# Altium project relayesp.PrjPcb
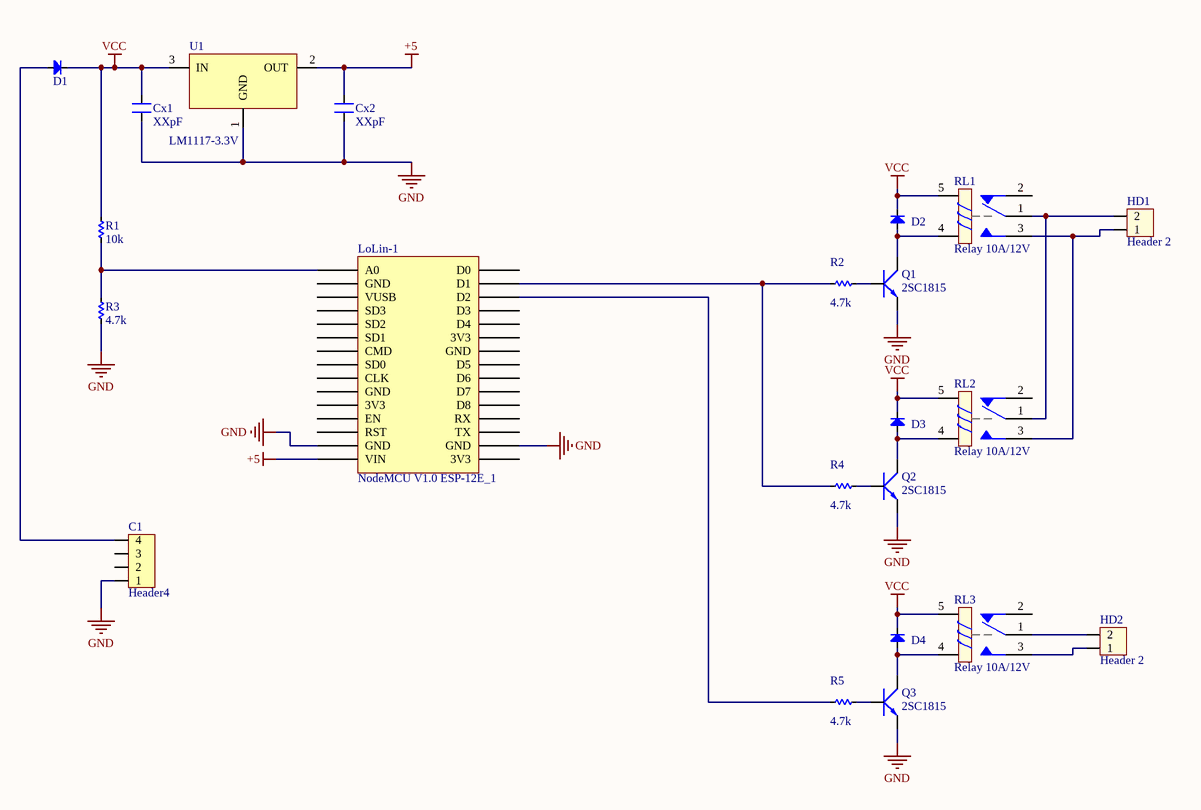
[diagram p0: schematic.SchDoc]
1 sheet, 22 parts. Net scope: global (net labels, ports and power ports of the same name join across sheets).
Board file: PCB1.PcbDoc

## Sheet schematic.SchDoc
size A4

### Parts
C1  Header4  [Header4]
Cx1  XXpF  [CN-SMD-1206]
Cx2  XXpF  [CN-SMD-1206]
D1  Diode  [DIO-1A-SMALL]  (value not drawn)
D2  Diode  [DIO-1A-SMALL]  (value not drawn)
D3  Diode  [DIO-1A-SMALL]  (value not drawn)
D4  Diode  [DIO-1A-SMALL]  (value not drawn)
HD1  Header 2  [HED2]
HD2  Header 2  [HED2]
LoLin-1  NodeMCU V1.0 ESP-12E_1  [LoLin NodeMcu V3]
Q1  2SC1815  [TO92-123]
Q2  2SC1815  [TO92-123]
Q3  2SC1815  [TO92-123]
R1  value 10k  [RES-1/4W-SMALL]  (hidden comment: Res)
R2  value 4.7k  [RES-1/4W-SMALL]  (hidden comment: Res)
R3  value 4.7k  [RES-1/4W-SMALL]  (hidden comment: Res)
R4  value 4.7k  [RES-1/4W-SMALL]  (hidden comment: Res)
R5  value 4.7k  [RES-1/4W-SMALL]  (hidden comment: Res)
RL1  Relay 10A/12V  [RELAY 5]
RL2  Relay 10A/12V  [RELAY 5]
RL3  Relay 10A/12V  [RELAY 5]
U1  LM1117-3.3V  [SOT223]

### Nets
+5: Cx2.2 LoLin-1.VIN U1.2(OUT)
GND: C1.1 Cx1.1 Cx2.1 LoLin-1.GND Q1.1(E) Q2.1(E) Q3.1(E) R3.2 U1.1(GND)
VCC: Cx1.2 D1.2(K) D2.2(K) D3.2(K) D4.2(K) R1.1 RL1.5 RL2.5 RL3.5 U1.3(IN)
NetC1_4: C1.4 D1.1(A)
NetD2_1: D2.1(A) Q1.2(C) RL1.4
NetD3_1: D3.1(A) Q2.2(C) RL2.4
NetD4_1: D4.1(A) Q3.2(C) RL3.4
NetHD1_1: HD1.1 RL1.3 RL2.3
NetHD1_2: HD1.2 RL1.1 RL2.1
NetHD2_1: HD2.1 RL3.3
NetHD2_2: HD2.2 RL3.1
NetLoLin-1_A0: LoLin-1.A0 R1.2 R3.1
NetLoLin-1_D1: LoLin-1.D1 R2.2 R4.2
NetLoLin-1_D2: LoLin-1.D2 R5.2
NetQ1_3: Q1.3(B) R2.1
NetQ2_3: Q2.3(B) R4.1
NetQ3_3: Q3.3(B) R5.1

Not connected (* = marked no-connect by the designer): C1 2 3; LoLin-1 3V3 CLK CMD D0 D3 D4 D5 D6 D7 D8 EN RST RX SD0 SD1 SD2 SD3 TX VUSB; RL1 2; RL2 2; RL3 2

### Library data of the parts
C1 = Header4: Header IDC, 4 x 1 Pin Vertical 2.54mm Pitch (Non-Boxed, Male); Manufacturer: W¨¹rth Elektronik eiSos GmbH; partNo: 613002143121; ComponentLink1 Description: Manufacturer; ComponentLink2 Description: Datasheet; NoPins: 02; Created Date: 29 March 2013; ComponentLink1URL: http://www.we-online.com; ComponentLink2URL: http://katalog.we-online.de/em/datasheet/6130xx143121.pdf; Created by: Karrer Zheng
Cx1 Cx2 = CN: Value: 33pF
D1-D4 = Diode: Default Diode; Code - JEDEC: DO-214-AB; Value: 1N5007; Published: 8-Jun-2000; Revision: July-2002: Re-released for DXP Platform.; Publisher: Altium Limited
HD1 HD2 = Hed2: Header 2 (Green); Value: Header 2
LoLin-1 = NodeMCU V1.0 ESP-12E_1: LoLin NodeMCU V3
Q1-Q3 = 2SC1815: NPN 600mW, ECB; Value: C1815
R1-R5 = Res: Manufacturer: Generic Components; Class: Passive; SubClass: R; Published: 08/06/2000; Publisher: Altium Hobart Technology Centre
RL1-RL3 = Relay 5: Relay SPDT,10A - 12VDC 5 Pin; Value: Relay SPDT, 10A, 12V
U1 = LM1117: 800mA Low-Dropout Linear Regulator; Creator: Nguyen Ba Bien; Website: http://group3i.net